# Altium schematic sheet Top.SchDoc
size A4
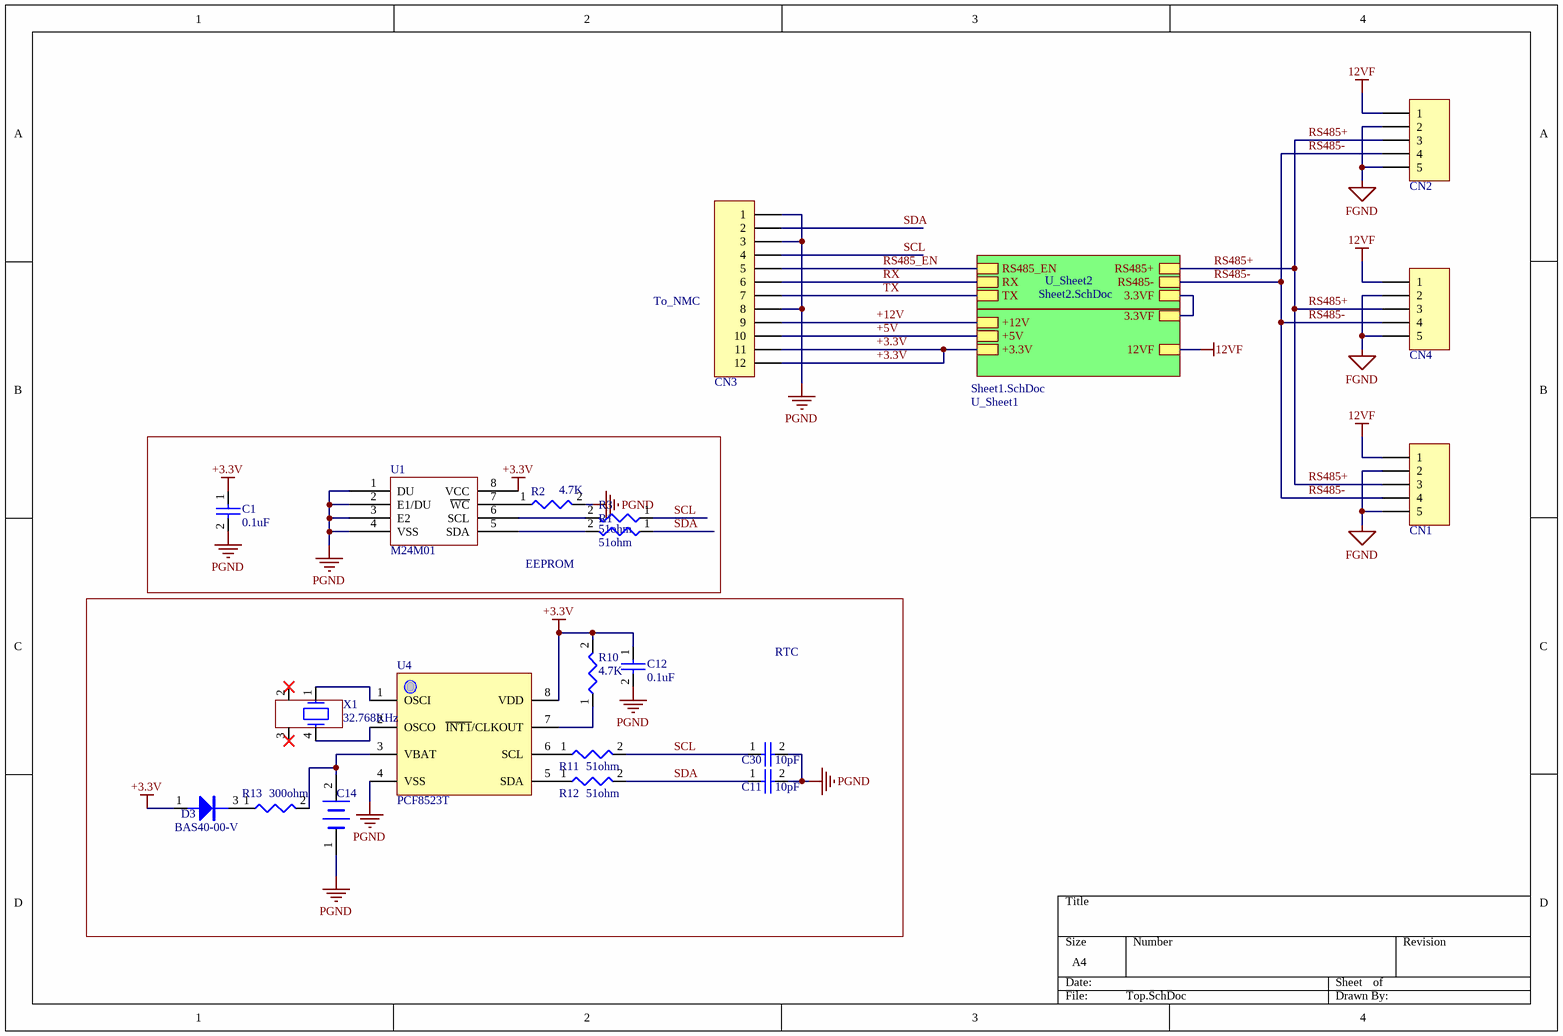
[diagram p0: Top.SchDoc]

## Parts
C1  value 0.1uF  [C0805]  (hidden comment: CAP)
C11  value 10pF  [C0805]  (hidden comment: CAP)
C12  value 0.1uF  [C0805]  (hidden comment: CAP)
C14  BATTERY  [DXJ_5R5H334U]  (value not drawn)
C30  value 10pF  [C0805]  (hidden comment: CAP)
CN1  Header 5  [70551-5P]  (value not drawn)
CN2  Header 5  [532590529]  (value not drawn)
CN3  Header 12  [353621276P2]  (value not drawn)
CN4  Header 5  [70551-5P]  (value not drawn)
D3  BAS40-00-V  [SOT23-123]
R1  value 51ohm  [R0805]  (hidden comment: RES)
R2  value 4.7K  [R0805]  (hidden comment: RES)
R3  value 51ohm  [R0805]  (hidden comment: RES)
R10  value 4.7K  [R0805]  (hidden comment: RES)
R11  value 51ohm  [R0805]  (hidden comment: RES)
R12  value 51ohm  [R0805]  (hidden comment: RES)
R13  value 300ohm  [R1206]  (hidden comment: RES)
U1  M24M01  [SOIC8]
U4  PCF8523T  [SO-8]
X1  value 32.768KHz  [MC306]  (hidden comment: MC306)

## Blocks framed on the sheet
EEPROM: C1 R1-R3 U1
RTC: C11 C12 C14 C30 D3 R10-R13 U4 X1

## Sub-sheets
U_Sheet1 = Sheet1.SchDoc: +3.3V, +5V, +12V, 12VF, 3.3VF
U_Sheet2 = Sheet2.SchDoc: RS485+, RS485-, RS485_EN, RX, TX, 3.3VF

## Nets
12VF: CN1.1 CN2.1 CN4.1 ; sheet U_Sheet1/12VF
+3.3V: C1.1 C12.1 CN3.11 CN3.12 D3.1 R10.2 U1.8(VCC) U4.8(VDD) ; sheet U_Sheet1/+3.3V
FGND: CN1.2 CN1.5 CN2.2 CN2.5 CN4.2 CN4.5
PGND: C1.2 C11.2 C12.2 C14.1(-) C30.2 CN3.1 CN3.3 CN3.8 R2.2 U1.1(DU) U1.2(E1/DU) U1.3(E2) U1.4(VSS) U4.4(VSS)
+5V: CN3.10 ; sheet U_Sheet1/+5V
+12V: CN3.9 ; sheet U_Sheet1/+12V
RS485+: CN1.3 CN2.3 CN4.3 ; sheet U_Sheet2/RS485+
RS485-: CN1.4 CN2.4 CN4.4 ; sheet U_Sheet2/RS485-
RS485_EN: CN3.5 ; sheet U_Sheet2/RS485_EN
RX: CN3.6 ; sheet U_Sheet2/RX
SCL: C30.1 CN3.4 R3.1 R11.2
SDA: C11.1 CN3.2 R1.1 R12.2
TX: CN3.7 ; sheet U_Sheet2/TX
NetC14_2: C14.2(+) R13.2 U4.3(VBAT)
NetD3_3: D3.3 R13.1
NetR1_2: R1.2 U1.5(SDA)
NetR2_1: R2.1 U1.7(~{WC})
NetR3_2: R3.2 U1.6(SCL)
NetR10_1: R10.1 U4.7(~{INT1}/CLKOUT)
NetR11_1: R11.1 U4.6(SCL)
NetR12_1: R12.1 U4.5(SDA)
NetU4_1: U4.1(OSCI) X1.1
NetU4_2: U4.2(OSCO) X1.4
(unnamed): sheet U_Sheet1/3.3VF, sheet U_Sheet2/3.3VF

Not connected (* = marked no-connect by the designer): X1 2* 3*

## Notes on the sheet
- To_NMC

## Library data of the parts
C1 C12 = EC00014: CAP SMD CR X7R 50V 10% 0.1uF 0805 ROHS; Manufacturer: YAGEO; Manufacturer P/N: CC0805KRX7R9BB104; ID: 14; HelpURL: *; P/N: EC00014
C11 C30 = EC00041: CAP SMD C0G 50V 10% 10pF 0805 ROHS; Manufacturer: YAGEO; Manufacturer P/N: CC0805JRNPO9BN100; ID: 41; HelpURL: *; P/N: EC00041
C14 = EC00046: CAP Super Capacitor,5.5V 0.33F 11.5X5MM ROHS; Manufacturer: ELNA; Manufacturer P/N: DXJ-5R5H334U; Value: 0.33F/5.5V; HelpU: \\192.168.1.3\Esh\Department\RD\CAD\Component\Capacitor\super cap\DXJ系列.pdf; ID: 46; Type: ****; P/N: EC00046
CN1 CN4 = EJ00030: CONNECTOR 5PIN,2.54PITCH,90 Degrees,PTH; Manufacturer: MOLEX; Value: 705510004; ID: 30; HelpURL: \\192.168.1.3\Esh\Department\RD\CAD\Component\connector\molex\705510004.pdf; P/N: EJ00030; Manufacturer P/N: 705510004
CN2 = EJ00018: CONNECTOR 5PIN,3.5PITCH,PTH,ROHS; Manufacturer: MOLEX; Value: 532590529; ID: 18; HelpURL: \\192.168.1.3\Esh\Department\RD\CAD\Component\connector\molex\532590529_sd.pdf; P/N: EJ00018; Manufacturer P/N: 532590529; Type: *****
CN3 = EJ00008: CONNECTOR 12PIN,2.00PITCH,PTH,2A,125V,ROHS,MATE_WITH:35507; Manufacturer: MOLEX; Value: 0353621276; ID: 8; HelpURL: \\192.168.1.3\Esh\Department\RD\CAD\Component\connector\molex\353621276_sd.pdf; P/N: EJ00008; Manufacturer P/N: 0353621276; Type: *****
D3 = ED00028: DIODE Schottky Diode 40V 0.2A SOT-23 SMD ROHS; Manufacturer: VISHAY; ID: 28; Type: ****; HelpURL: \\192.168.1.3\Esh\Department\RD\CAD\Component\DIODE\bas40v.pdf; P/N: ED00028; Manufacturer P/N: BAS40-00-V; Value: BAS40-00-V
R1 R3 R11 R12 = ER00085: RES THICK_FILM SMD 51 OHM 5% 1/8W ROHS 0805; Manufacturer: YAGEO; Manufacturer P/N: RC0805JR-0751RL; ID: 85; HelpURL: *; P/N: ER00085
R2 R10 = ER00039: RES THICK_FILM SMD 4.7K 5% 1/8W ROHS 0805; Manufacturer: YAGEO; Manufacturer P/N: RC0805JR-074K7L; ID: 39; HelpURL: *; P/N: ER00039
R13 = ER00017: RES THICK_FILM SMD 300 OHM 1% 1/4W ROHS 1206; Manufacturer: YAGEO; Manufacturer P/N: RC1206FR-07300RL; ID: 17; HelpURL: *; P/N: ER00017
U1 = EU00047: IC 1-Mbit serial I2C bus EEPROM; Manufacturer P/N: M24M01-RMN6TP; Manufacturer: ST; ID: 47; Value: M24M01-RMN6TP; HelpURL: \\192.168.1.3\Esh\Department\RD\CAD\Component\EEPROM\M24M01-RMN6TP.pdf; P/N: EU00047; Type: *****
U4 = EU00044: IC Real-Time Clock (RTC) and calendar,SO8，ROHS; Manufacturer P/N: PCF8523T/1; Manufacturer: NXP; ID: 44; Value: PCF8523T/1; HelpURL: \\192.168.1.3\Esh\Department\RD\CAD\Component\RTC\PCF8523.pdf; P/N: EU00044; Type: *****
X1 = EX00004: XTAL 8.0*3.8*2.5 32.768KHZ 6PF, +/-20PPM,SMD ROHS; Manufacturer: Atop Electronic Technology Co.,Ltd.; Manufacturer P/N: AX8038-32.768K-6P2030C; ID: 4; HelpURL: \\192.168.1.3\Esh\Department\RD\CAD\Component\Crystal\AX8038-32.768K-6P2030C.pdf; P/N: EX00004; Type: *****